# EAGLE design igvv (EAGLE 9.6.2)
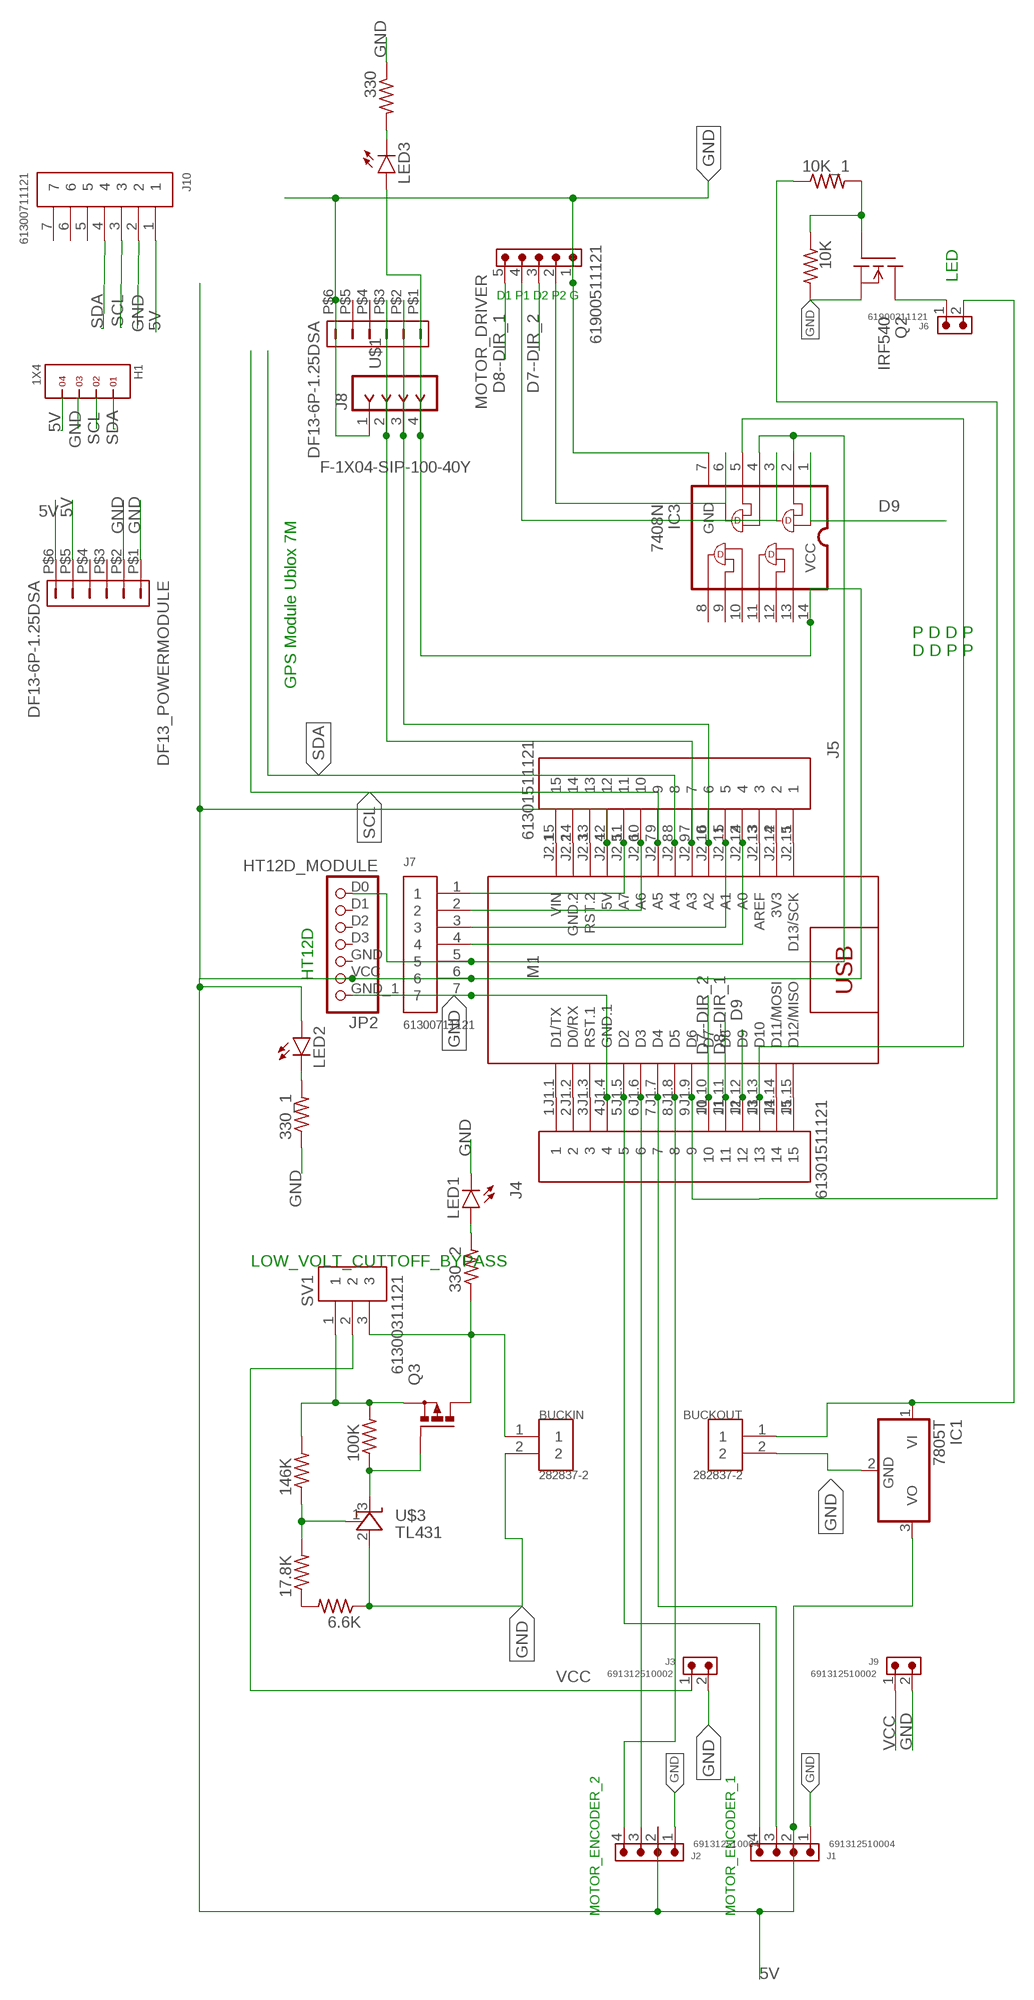
[diagram p0: schematic, sheet 1]

## Parts
6.6K  R-US_0207/10  [0207/10]
10K  R-US_0207/10  [0207/10]
10K_1  R-US_0207/10  [0207/10]
17.8K  R-US_0207/10  [0207/10]
100K  R-US_0207/10  [0207/10]
146K  R-US_0207/10  [0207/10]
330  R-US_0207/10  [0207/10]
330_1  R-US_0207/10  [0207/10]
330_2  R-US_0207/10  [0207/10]
BUCKIN  282837-2  [TE_282837-2]
BUCKOUT  282837-2  [TE_282837-2]
DF13_POWERMODULE  DF13-6P-1.25DSA  [DF13-6P-1.25DSA]
H1  1X4  [1X4]
IC1  7805T  [TO220H]
IC3  7408N  [DIL14]
J1  691312510004  691312510004  [691312510004]
J2  691312510004  691312510004  [691312510004]
J3  691312510002  691312510002  [691312510002]
J4  61301511121  [61301511121]
J5  61301511121  [61301511121]
J6  61900211121  61900211121  [61900211121]
J7  61300711121  [61300711121]
J8  F-1X04-SIP-100-40Y  [SIP-100-04-40Y]
J9  691312510002  691312510002  [691312510002]
J10  61300711121  [61300711121]
JP2  HT12D_MODULE  [HT12D_MODULE]
LED1  LED5MM  [LED5MM]
LED2  LED5MM  [LED5MM]
LED3  LED5MM  [LED5MM]
M1  ARDUINO-NANO-3.0ARDUINO-NANO-3.0  [ARDUINO-NANO-3.0]
MOTOR_DRIVER  61900511121  61900511121  [61900511121]
Q2  IRF540  [TO220]
Q3  PMOSFET_PTO220BV  [TO220BV]
SV1  61300311121  [61300311121]
U$1  DF13-6P-1.25DSA  [DF13-6P-1.25DSA]
U$3  TL431  [TO-92]

## Nets
5V: DF13_POWERMODULE.P$5 DF13_POWERMODULE.P$6 H1.4 IC1.3(VO) IC3.14(VCC) J1.2 J2.2 J5.12 J7.6 J8.4 J10.1 JP2.VCC LED2.A LED3.A M1.J2.4(5V) U$1.P$1
A2: J5.6 J8.3 M1.J2.10(A2) U$1.P$2
D4: J1.3 J4.7 M1.J1.7(D4)
D7--DIR_2: J4.10 M1.J1.10(D7) MOTOR_DRIVER.3
D8--DIR_1: J4.11 M1.J1.11(D8) MOTOR_DRIVER.5
D9: IC3.1 J4.12 M1.J1.12(D9)
GND: 6.6K.1 10K.2 330.1 330_1.1 BUCKIN.2 BUCKOUT.2 DF13_POWERMODULE.P$1 DF13_POWERMODULE.P$2 H1.3 IC1.2(GND) IC3.7(GND) J1.1 J2.1 J3.2 J4.4 J7.7 J8.1 J9.2 J10.2 JP2.GND_1 LED1.K(C) M1.J1.4(GND.1) MOTOR_DRIVER.1 Q2.3(S) U$1.P$6 U$3.2(A)
N$1: 6.6K.2 17.8K.1
N$2: 17.8K.2 146K.1 U$3.1(REF)
N$3: J1.4 J4.5 M1.J1.5(D2)
N$4: 100K.1 Q3.G U$3.3(C)
N$5: 330_2.1 BUCKIN.1 Q3.D SV1.3
N$6: 100K.2 146K.2 Q3.S SV1.1
N$7: BUCKOUT.1 IC1.1(VI) J6.2
N$8: J2.3 J4.6 M1.J1.6(D3)
N$9: J2.4 J4.8 M1.J1.8(D5)
N$10: 10K_1.1 J4.9 M1.J1.9(D6)
N$11: 330.2 LED3.K(C)
N$12: J5.4 J7.4 M1.J2.12(A0)
N$13: J5.5 J7.3 M1.J2.11(A1)
N$14: J5.10 J7.2 M1.J2.6(A6)
N$15: J5.11 J7.1 M1.J2.5(A7)
N$16: 330_2.2 LED1.A
N$17: 330_1.2 LED2.K(C)
N$21: J4.1 M1.J1.1(D1/TX)
N$22: J5.7 J8.2 M1.J2.9(A3) U$1.P$3
N$27: IC3.2 IC3.4 J7.5 JP2.D0
N$28: J4.2 M1.J1.2(D0/RX)
N$29: J4.3 M1.J1.3(RST.1)
N$31: J4.14 M1.J1.14(D11/MOSI)
N$32: J4.15 M1.J1.15(D12/MISO)
N$33: J5.1 M1.J2.15(D13/SCK)
N$34: J5.2 M1.J2.14(3V3)
N$35: J5.3 M1.J2.13(AREF)
N$36: J5.13 M1.J2.3(RST.2)
N$37: J5.14 M1.J2.2(GND.2)
N$38: J5.15 M1.J2.1(VIN)
N$39: 10K.1 10K_1.2 Q2.1(G)
N$40: J6.1 Q2.2(D)
N$42: IC3.5 J4.13 M1.J1.13(D10)
N$47: IC3.3 MOTOR_DRIVER.4
N$48: IC3.6 MOTOR_DRIVER.2
SCL: H1.2 J5.9 J10.3 M1.J2.7(A5)
SDA: H1.1 J5.8 J10.4 M1.J2.8(A4)
VCC: J3.1 J9.1 SV1.2
Unconnected: DF13_POWERMODULE.P$3 DF13_POWERMODULE.P$4 IC3.8 IC3.9 IC3.10 IC3.11 IC3.12 IC3.13 J10.5 J10.6 J10.7 JP2.D1 JP2.D2 JP2.D3 JP2.GND U$1.P$4 U$1.P$5

## Notes on the sheet
- LED
- D1 P1 D2 P2 G
- GPS Module Ublox 7M
- P D D P
  D D P P
- HT12D
- LOW_VOLT_CUTTOFF_BYPASS
- MOTOR_ENCODER_2 | MOTOR_ENCODER_1

## Library data of the parts
6.6K 10K 10K_1 17.8K 100K 146K 330 330_1 330_2 = rcl:R-US_: RESISTOR, American symbol; SPICEPREFIX: R
BUCKIN BUCKOUT = 282837-2:282837-2: TERM BLOCK 5.08MM 2POS SIDE ENTY Check availability <https://pricing.snapeda.com/parts/282837-2/TE%20Connectivity/view-part?ref=eda>; AVAILABILITY: In Stock; CHECK_PRICES: https://www.snapeda.com/parts/282837-2/TE+Connectivity+AMP+Connectors/view-part/?ref=eda; COMMENT: 282837-2; DESCRIPTION: Terminal Block Connector Wire Receptacle 2 5.08 mm 30-16 AWG Green 13.5 A 250 V | TE Connectivity 282837-2; MF: TE Connectivity; MP: 282837-2; PACKAGE: None; PRICE: None; PURCHASE-URL: https://www.snapeda.com/api/url_track_click_mouser/?unipart_id=2549980&manufacturer=TE Connectivity&part_name=282837-2&search_term=None; SNAPEDA_LINK: https://www.snapeda.com/parts/282837-2/TE+Connectivity+AMP+Connectors/view-part/?ref=snap
DF13_POWERMODULE U$1 = con-hirose-df13:DF13-6P-1.25: DF13-6P 1.25mm Pitch Miniature Crimping Connector.
H1 = headers(.1in):1X4
IC1 = igvc_custom:7805: Positive VOLTAGE REGULATOR Source: http://cache.national.com/ds/LM/LM78L05.pdf http://www.fairchildsemi.com/ds/LM/LM7805.pdf
IC3 = igvc_custom:7408: Quad 2-input AND gate
J1 J2 = Wurth_Connectors_WR-TBL Pluggable Connector:691312510004: WR-TBL Serie 312 - 5.08 mm Open Horizontal PCB Header KIND PROPERTIES Pitch 5.08 mm MATERIAL PROPERTIES Insulator Material PBT Insulator Flammability Rating UL94 V-0 Contact Material Brass Contact Plating Tin GENERAL INFORMATION Operating Temperature -40 up to +105 °C Compliance RoHS ELECTRICAL PROPERTIES IR cULus 20 A IR VDE 20 A Working Voltage [cULus] 300 V (AC) Working Voltage [VDE] 300 V (AC) Withstanding Voltage [cULus] 1600 V (AC) Withstanding Voltage [VDE] 2500 V (AC) Contact Resistance [cULus] 20 mΩ Contact Resistance [VDE] 20 mΩ CERTIFICATION cULus Approval E315414 VDE Approval 40023195 <https://www.we-online.com/catalog/media/o33262v209%20Family_WR-TBL_6913125100xx.jpg> Details see: https://www.we-online.com/catalog/en/TBL_5_08_312_OPEN_HORIZONTAL_PCB_HEADER_6913125100XX/ Updated by Ella Wu 2019-12-26 2019(C) Wurth Elektronik; DATASHEET-URL: https://www.we-online.com/catalog/datasheet/691312510004.pdf; IR-UL: 20A; IR-VDE: 20A; MOUNT: THT; PART-NUMBER: 691312510004; PINS: 4; PITCH: 5.08mm; TYPE: Horizontal; WORKING-VOLTAGE-UL: 300V (AC); WORKING-VOLTAGE-VDE: 300V (AC)
J3 J9 = Wurth_Connectors_WR-TBL Pluggable Connector:691312510002: WR-TBL Serie 312 - 5.08 mm Open Horizontal PCB Header KIND PROPERTIES Pitch 5.08 mm MATERIAL PROPERTIES Insulator Material PA66 Insulator Flammability Rating UL94 V-0 Contact Material Brass Contact Plating Tin GENERAL INFORMATION Operating Temperature -40 up to +105 °C Compliance RoHS ELECTRICAL PROPERTIES IR cULus 20 A IR VDE 20 A Working Voltage [cULus] 300 V (AC) Working Voltage [VDE] 300 V (AC) Withstanding Voltage [cULus] 1600 V (AC) Withstanding Voltage [VDE] 2500 V (AC) Contact Resistance [cULus] 20 mΩ Contact Resistance [VDE] 20 mΩ CERTIFICATION cULus Approval E315414 VDE Approval 40023195 <https://www.we-online.com/catalog/media/o33262v209%20Family_WR-TBL_6913125100xx.jpg> Details see: https://www.we-online.com/catalog/en/TBL_5_08_312_OPEN_HORIZONTAL_PCB_HEADER_6913125100XX/ Updated by Ella Wu 2019-12-26 2022(C) Wurth Elektronik; DATASHEET-URL: https://www.we-online.com/redexpert/spec/691312510002?ae; IR-UL: 20A; IR-VDE: 20A; MOUNT: THT; PART-NUMBER: 691312510002; PINS: 2; PITCH: 5.08mm; TYPE: Horizontal; WORKING-VOLTAGE-UL: 300V (AC); WORKING-VOLTAGE-VDE: 300V (AC)
J4 J5 = Headers:61301511121: CONN HEADER VERT 15POS 2.54MM Manufacturer's datasheet <https://katalog.we-online.de/em/datasheet/6130xx11121.pdf>; CREATED_BY: PCBLayout.com; DIGIKEY_PART_NUMBER: 732-5326-ND; MANUFACTURER: Wurth Electronics Inc.; MPN: 61301511121
J6 = Wurth_Connectors_WR-WTB:61900211121: WR-WTB 2.54 mm Male Locking Header KIND PROPERTIES: Pitch:2.54 mm Gender:Male MATERIAL PROPERTIES: Insulator Material :PA66 Insulator Flammability Rating:UL94 V-0 Insulator Color:Beige Contact Material:Copper Alloy Contact Plating:Tin Contact Type:Stamped GENERAL INFORMATION Operating Temperature:-40 up to +105 °C Compliance: RoHS Working Voltage:250 V (AC) Withstanding Voltage:1000 V (AC) Contact Resistance:20 mΩ RISO:1000 MΩ CERTIFICATION UL Approval:E323964 PACKAGING PROPERTIES Packaging:Bag <https://katalog.we-online.com/media/images/v2/o33345v209%20Family_WR-WTB_6190xx11121.jpg> Details see: https://katalog.we-online.com/en/em/WTB_2_54_MALE_LOCKING_HEADER_6190XX11121 Updated by Ella Wu 2020-07-08 2020 (C) Würth Elektronik; CONTACT-RESISTANCE: 20mOhm; DATASHEET-URL: https://www.we-online.com/catalog/datasheet/61900211121.pdf; GENDER: Male; L: 5.08mm; MOUNT: THT; PACKAGING: Bag; PART-NUMBER: 61900211121; PCB-CABLE-PANEL: PCB; PINS: 2; PITCH: 2.54mm; TOL-R: max.; TYPE: Vertical; USE-WITH: WR-WTB 2.54 mm Female Terminal Housing; WORKING-VOLTAGE: 250V(AC)
J7 J10 = Headers:61300711121: CONN HEADER VERT 7POS 2.54MM Manufacturer's datasheet <https://katalog.we-online.de/em/datasheet/6130xx11121.pdf>; CREATED_BY: PCBLayout.com; DIGI_KEY_PART_NUMBER: 732-5320-ND; MANUFACTURER: Wurth Electronics Inc.; MPN: 61300711121
J8 = con-headers-jp:F-1X04-: FEMALE HEADER
JP2 = igvc_custom:HT12D_MODULE
LED1-LED3 = led:LED: LED OSRAM: - CHIPLED LG R971, LG N971, LY N971, LG Q971, LY Q971, LO R971, LY R971 LH N974, LH R974 LS Q976, LO Q976, LY Q976 LO Q996 - Hyper CHIPLED LW Q18S LB Q993, LB Q99A, LB R99A - SideLED LS A670, LO A670, LY A670, LG A670, LP A670 LB A673, LV A673, LT A673, LW A673 LH A674 LY A675 LS A676, LA A676, LO A676, LY A676, LW A676 LS A679, LY A679, LG A679 - Hyper Micro SIDELED® LS Y876, LA Y876, LO Y876, LY Y876 LT Y87S - SmartLED LW L88C, LW L88S LB L89C, LB L89S, LG L890 LS L89K, LO L89K, LY L89K LS L896, LA L896, LO L896, LY L896 - TOPLED LS T670, LO T670, LY T670, LG T670, LP T670 LSG T670, LSP T670, LSY T670, LOP T670, LYG T670 LG T671, LOG T671, LSG T671 LB T673, LV T673, LT T673, LW T673 LH T674 LS T676, LA T676, LO T676, LY T676, LB T676, LH T676, LSB T676, LW T676 LB T67C, LV T67C, LT T67C, LS T67K, LO T67K, LY T67K, LW E67C LS E67B, LA E67B, LO E67B, LY E67B, LB E67C, LV E67C, LT E67C LW T67C LS T679, LY T679, LG T679 LS T770, LO T770, LY T770, LG T770, LP T770 LB T773, LV T773, LT T773, LW T773 LH T774 LS E675, LA E675, LY E675, LS T675 LS T776, LA T776, LO T776, LY T776, LB T776 LHGB T686 LT T68C, LB T68C - Hyper Mini TOPLED® LB M676 - Mini TOPLED Santana® LG M470 LS M47K, LO M47K, LY M47K Source: http://www.osram.convergy.de LUXEON: - LUMILED® LXK2-PW12-R00, LXK2-PW12-S00, LXK2-PW14-U00, LXK2-PW14-V00 LXK2-PM12-R00, LXK2-PM12-S00, LXK2-PM14-U00 LXK2-PE12-Q00, LXK2-PE12-R00, LXK2-PE12-S00, LXK2-PE14-T00, LXK2-PE14-U00 LXK2-PB12-K00, LXK2-PB12-L00, LXK2-PB12-M00, LXK2-PB14-N00, LXK2-PB14-P00, LXK2-PB14-Q00 LXK2-PR12-L00, LXK2-PR12-M00, LXK2-PR14-Q00, LXK2-PR14-R00 LXK2-PD12-Q00, LXK2-PD12-R00, LXK2-PD12-S00 LXK2-PH12-R00, LXK2-PH12-S00 LXK2-PL12-P00, LXK2-PL12-Q00, LXK2-PL12-R00 Source: www.luxeon.com KINGBRIGHT: KA-3528ASYC Source: www.kingbright.com
M1 = igvc_custom:ARDUINO-NANO-3.0: Arduino Nano 3.0 and compatible devices More details available here: https://www.arduino.cc/en/Main/ArduinoBoardNano Click here to find device on ebay.com <http://www.ebay.com/sch/arduino+nano>
MOTOR_DRIVER = Wurth_Connectors_WR-WTB:61900511121: WR-WTB 2.54 mm Male Locking Header KIND PROPERTIES: Pitch:2.54 mm Gender:Male MATERIAL PROPERTIES: Insulator Material :PA66 Insulator Flammability Rating:UL94 V-0 Insulator Color:Beige Contact Material:Copper Alloy Contact Plating:Tin Contact Type:Stamped GENERAL INFORMATION Operating Temperature:-40 up to +105 °C Compliance: RoHS Working Voltage:250 V (AC) Withstanding Voltage:1000 V (AC) Contact Resistance:20 mΩ RISO:1000 MΩ CERTIFICATION UL Approval:E323964 PACKAGING PROPERTIES Packaging:Bag <https://katalog.we-online.com/media/images/v2/o33345v209%20Family_WR-WTB_6190xx11121.jpg> Details see: https://katalog.we-online.com/en/em/WTB_2_54_MALE_LOCKING_HEADER_6190XX11121 Updated by Ella Wu 2020-07-08 2020 (C) Würth Elektronik; CONTACT-RESISTANCE: 20mOhm; DATASHEET-URL: https://www.we-online.com/catalog/datasheet/61900511121.pdf; GENDER: Male; L: 12.7mm; MOUNT: THT; PACKAGING: Bag; PART-NUMBER: 61900511121; PCB-CABLE-PANEL: PCB; PINS: 5; PITCH: 2.54mm; TOL-R: max.; TYPE: Vertical; USE-WITH: WR-WTB 2.54 mm Female Terminal Housing; WORKING-VOLTAGE: 250V(AC)
Q2 = igvc_custom:IRF540: N-Channel Enhancement MOSFET (HEXFET); 100V; 28A; 0,077Ohm
Q3 = transistor-power:PMOSFET_P: Power MOSFET P-Channel
SV1 = Headers:61300311121: CONN HEADER VERT 3POS 2.54MM Manufacturer's datasheet <https://katalog.we-online.de/em/datasheet/6130xx11121.pdf>; CREATED_BY: PCBLayout.com; DIGI_KEY_PART_NUMBER: 732-5316-ND; MANUFACTURER: Wurth Electronics Inc.; MPN: 61300311121
U$3 = GuShH:TL431

## Board
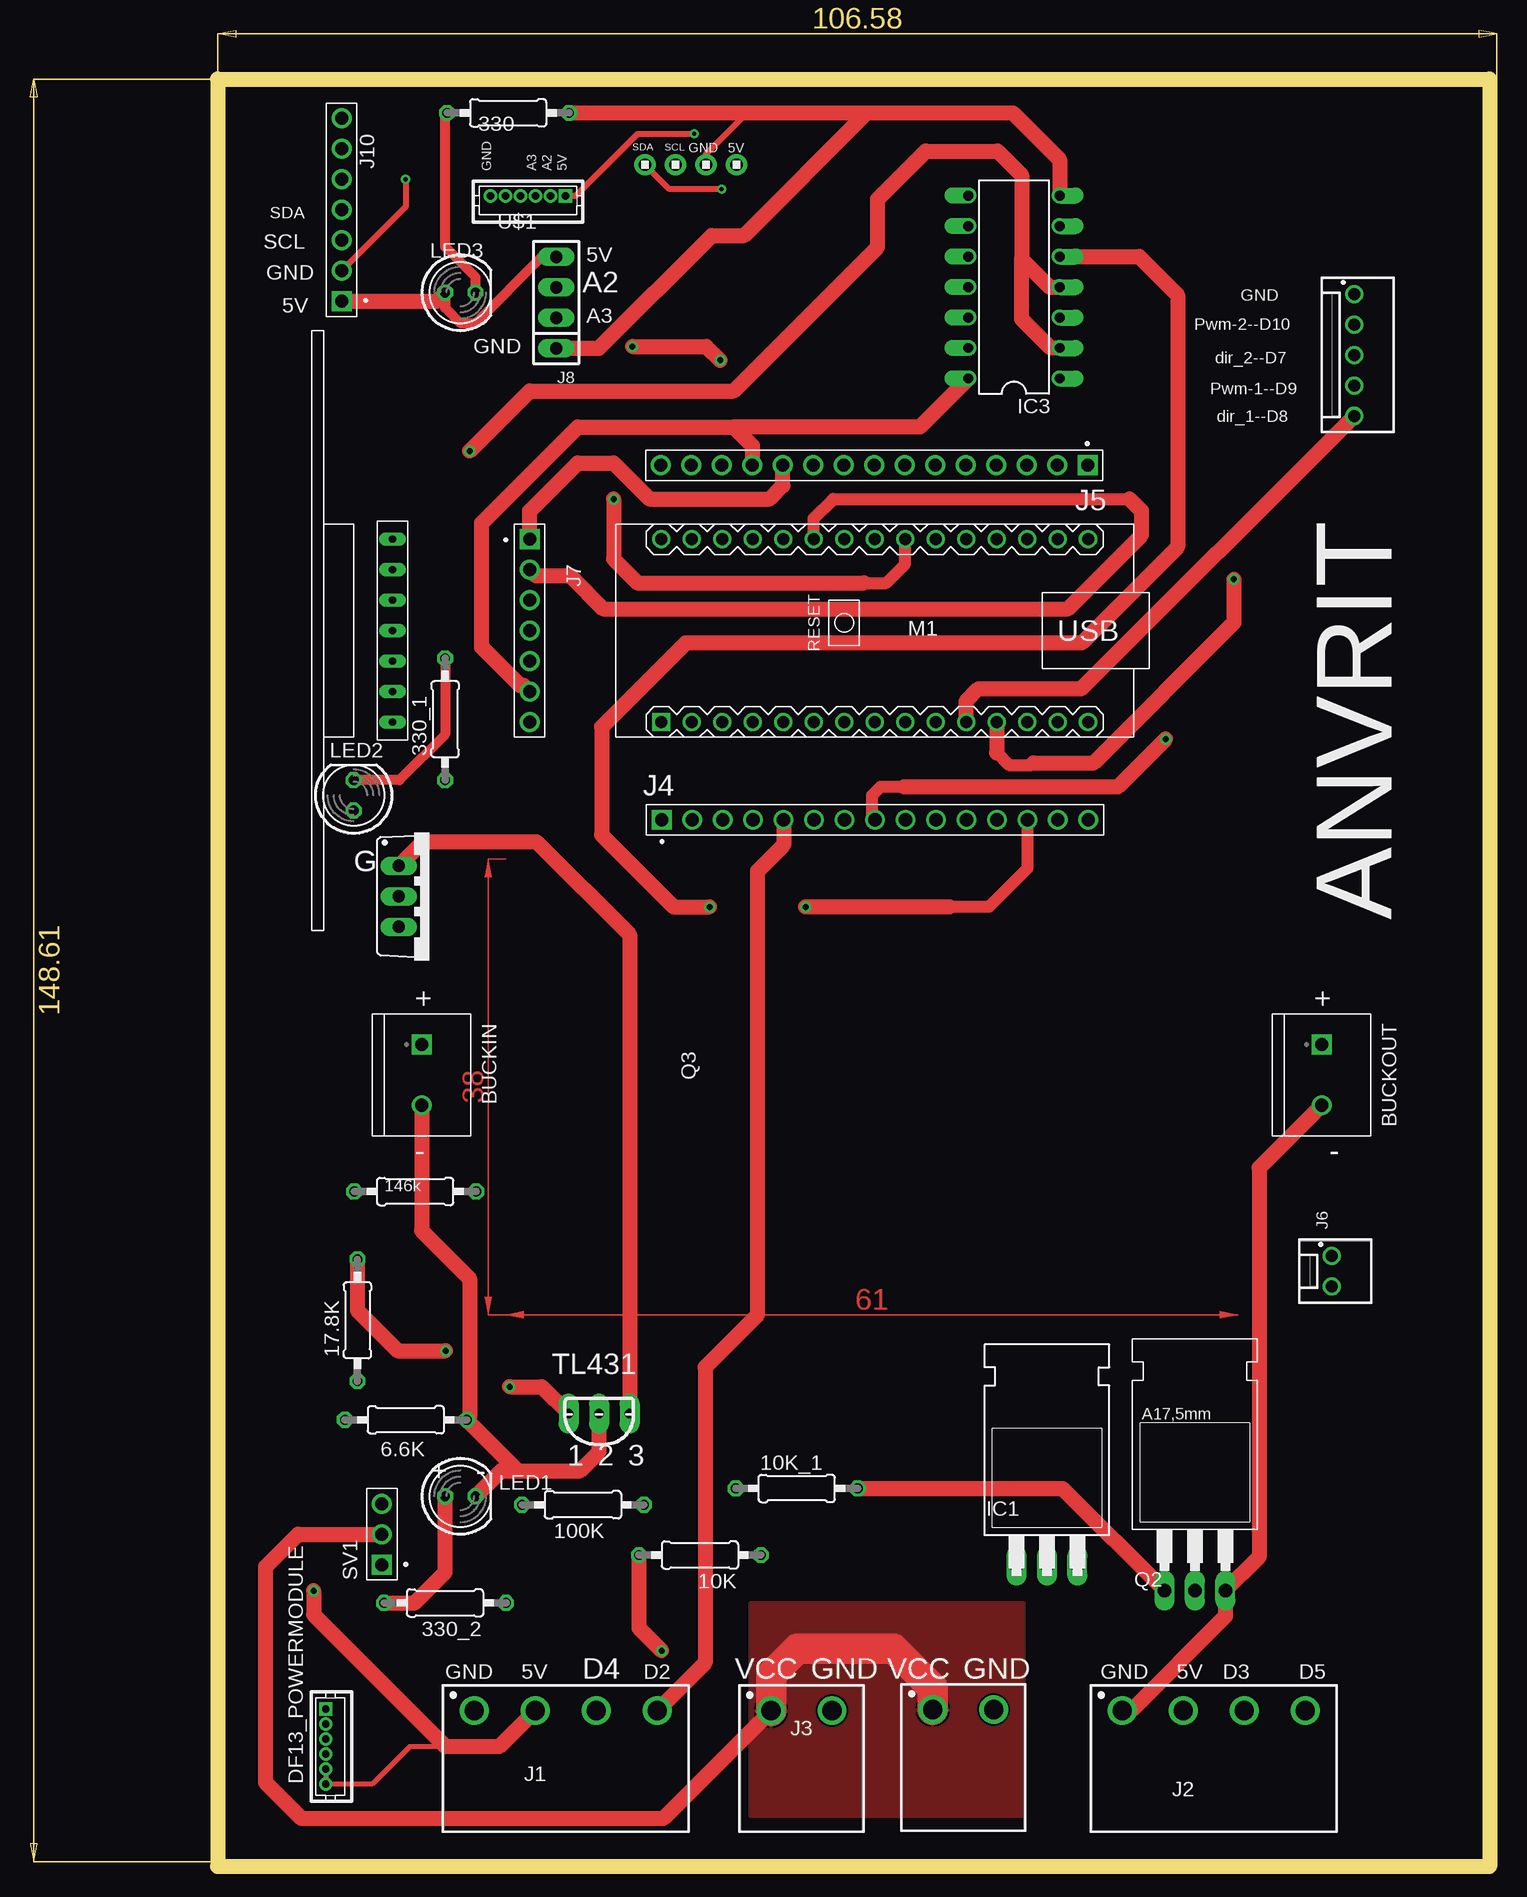
[diagram p1: board, top side]
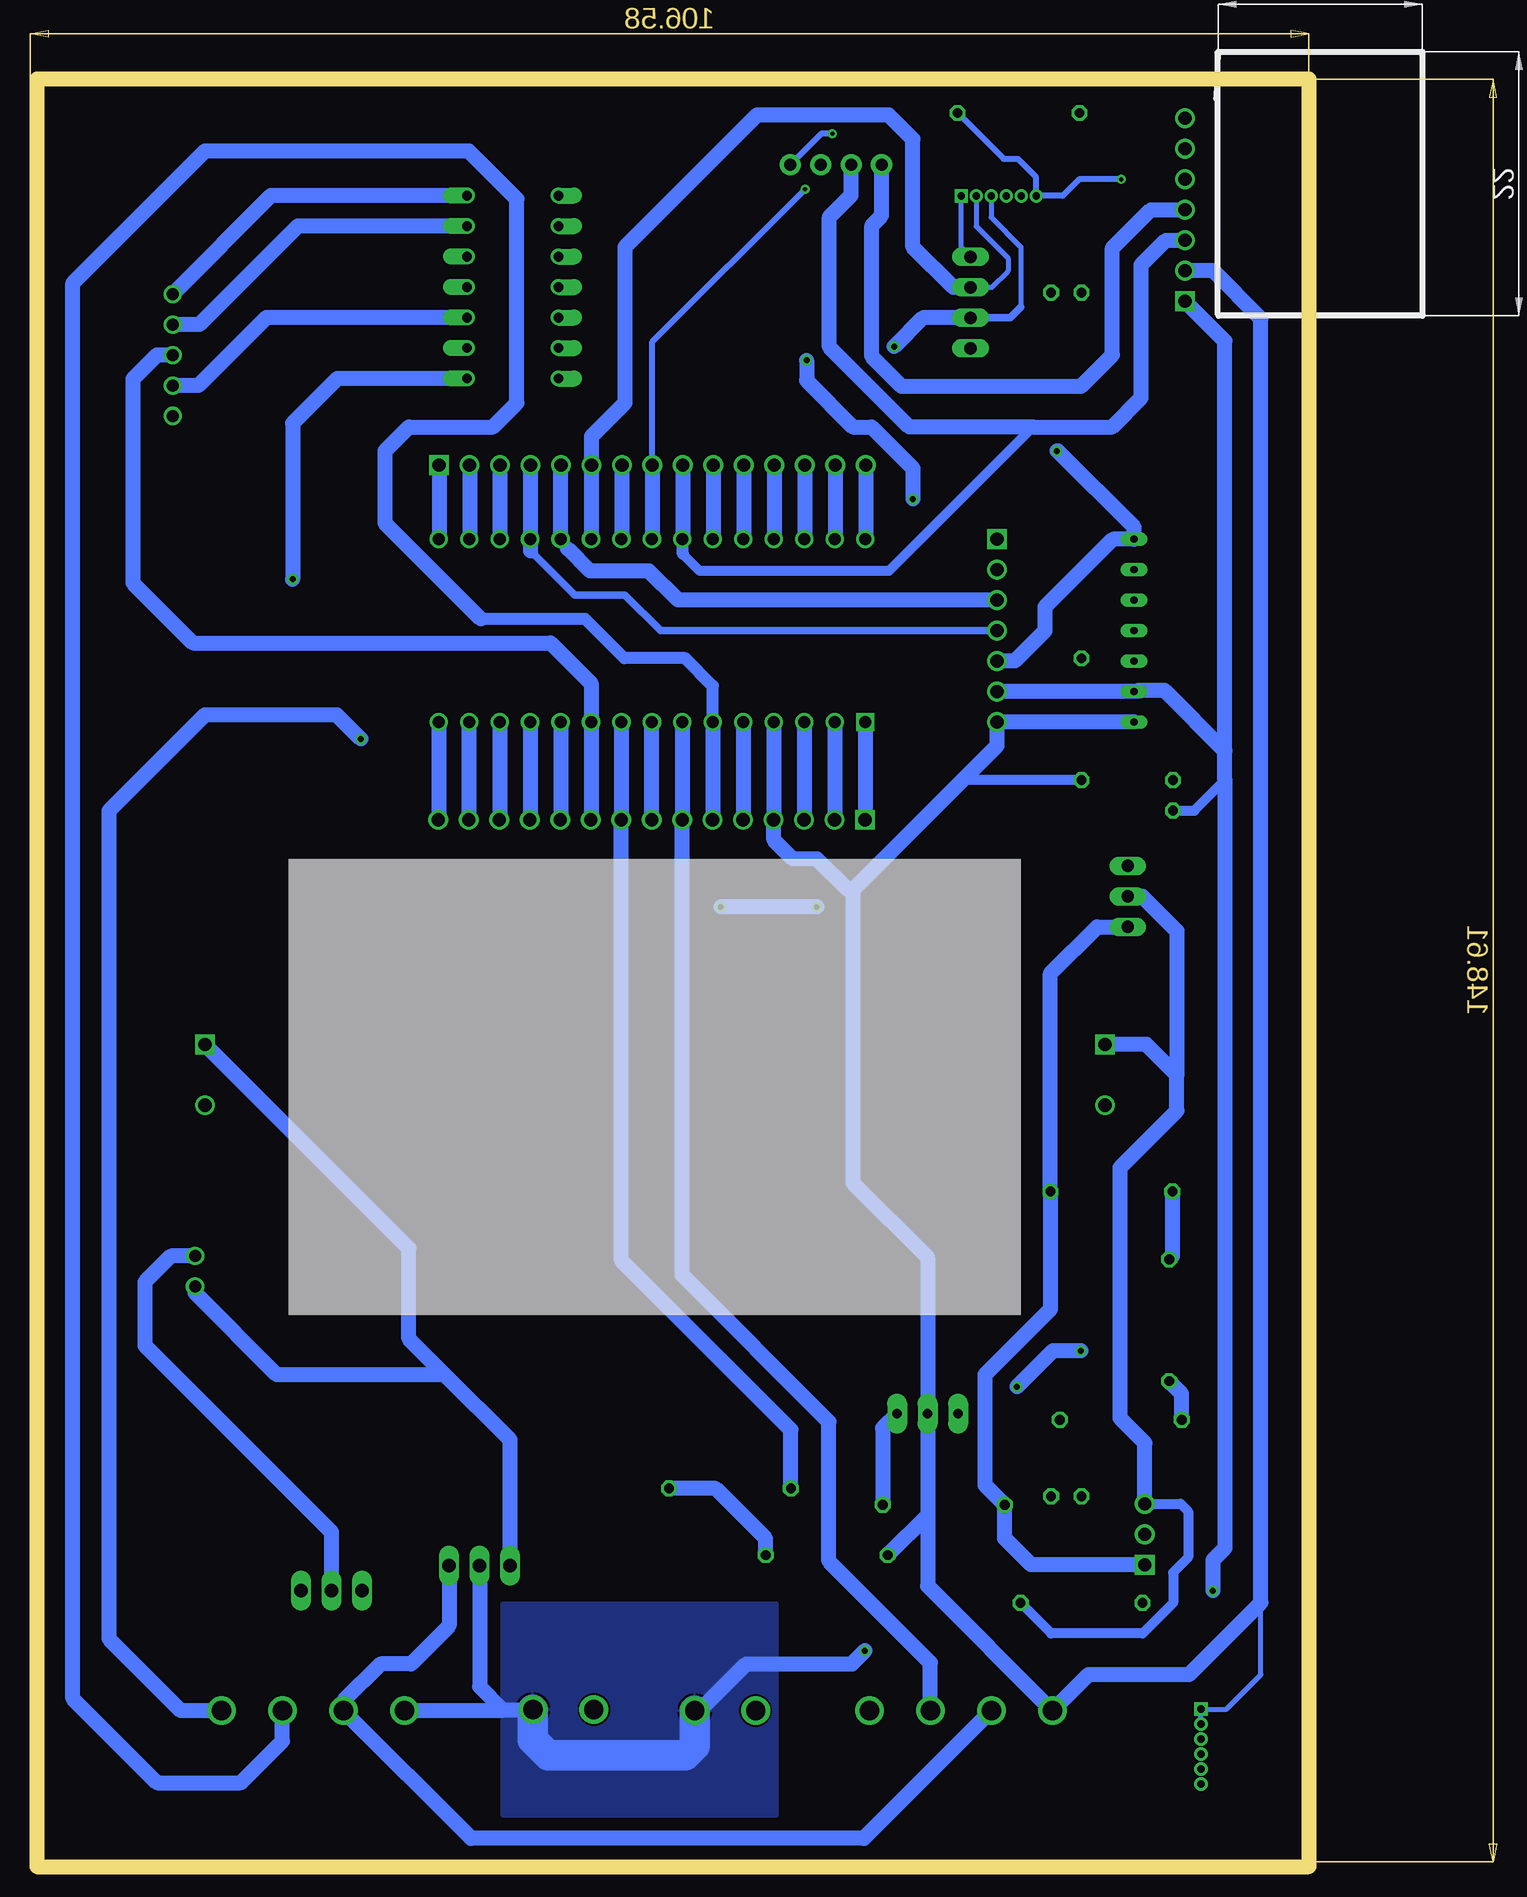
[diagram p2: board, bottom side, seen from below]

Size 106 x 149 mm. Coordinates in mm from the lower left corner, seen from the top.
Outline: 106,149 106,0 0,0 0,149 106,149
Copper layers (1*16): Top 0.035mm / dielectric 1.5mm / Bottom 0.035mm
Design rules "default": minimum track width 6mil, minimum drill 0.35mm, track to track 6mil, track to pad 6mil, pad to pad 6mil, via to via 6mil, smd to smd 6mil, copper to edge 40mil, drill to drill 6mil, minimum pad ring 10mil, minimum via ring 8mil, stop-mask expansion 4mil, vias tented up to drill 0mil, thermal gap 10mil

### Footprints (pad centres in the part's own frame; a part is rotated, then mirrored left to right if it is on the bottom)
0207/10 = drill 0.813 octagon: 1 -5.08,0; 2 5.08,0
TE_282837-2 = drill 1.1 square: 1 -2.54,0 | drill 1.1: 2 2.54,0
DF13-6P-1.25DSA = drill 0.6 pad 1.016 square: P$1 3.125,0 | drill 0.6 pad 1.016: P$2 1.875,0; P$3 0.625,0; P$4 -0.625,0; P$5 -1.875,0; P$6 -3.125,0
1X4 = drill 1.016 pad 1.778: 1 0,0; 2 2.54,0; 3 5.08,0; 4 7.62,0
TO220H = drill 1.118 long: 1 -2.54,-10.16; 2 0,-10.16; 3 2.54,-10.16
DIL14 = drill 0.813 offset: 1 -7.62,-3.81; 2 -5.08,-3.81; 3 -2.54,-3.81; 4 0,-3.81; 5 2.54,-3.81; 6 5.08,-3.81; 7 7.62,-3.81; 8 7.62,3.81; 9 5.08,3.81; 10 2.54,3.81; 11 0,3.81; 12 -2.54,3.81; 13 -5.08,3.81; 14 -7.62,3.81
691312510004 = drill 1.6: 1 -7.62,0; 2 -2.54,0; 3 2.54,0; 4 7.62,0
691312510002 = drill 1.6: 1 -2.54,0; 2 2.54,0
61301511121 = drill 1.1 square: 1 -17.78,0 | drill 1.1: 2 -15.24,0; 3 -12.7,0; 4 -10.16,0; 5 -7.62,0; 6 -5.08,0; 7 -2.54,0; 8 0,0; 9 2.54,0; 10 5.08,0; 11 7.62,0; 12 10.16,0; 13 12.7,0; 14 15.24,0; 15 17.78,0
61900211121 = drill 1: 1 1.27,0.3; 2 -1.27,0.3
61300711121 = drill 1.1 square: 1 -7.62,0 | drill 1.1: 2 -5.08,0; 3 -2.54,0; 4 0,0; 5 2.54,0; 6 5.08,0; 7 7.62,0
SIP-100-04-40Y = drill 1.016 long: 1 -3.81,0; 2 -1.27,0; 3 1.27,0; 4 3.81,0
HT12D_MODULE = drill 0.6 long: D0 -7.62,-1.27; D1 -5.08,-1.27; D2 -2.54,-1.27; D3 0,-1.27; GND 2.54,-1.27; GND_1 7.62,-1.27; VCC 5.08,-1.27
LED5MM = drill 0.813 octagon: A -1.27,0; K 1.27,0
ARDUINO-NANO-3.0 = drill 1 square: J1.1 17.78,7.62 | drill 1: J1.2 15.24,7.62; J1.3 12.7,7.62; J1.4 10.16,7.62; J1.5 7.62,7.62; J1.6 5.08,7.62; J1.7 2.54,7.62; J1.8 0,7.62; J1.9 -2.54,7.62; J1.10 -5.08,7.62; J1.11 -7.62,7.62; J1.12 -10.16,7.62; J1.13 -12.7,7.62; J1.14 -15.24,7.62; J1.15 -17.78,7.62; J2.1 17.78,-7.62; J2.2 15.24,-7.62; J2.3 12.7,-7.62; J2.4 10.16,-7.62; J2.5 7.62,-7.62; J2.6 5.08,-7.62; J2.7 2.54,-7.62; J2.8 0,-7.62; J2.9 -2.54,-7.62; J2.10 -5.08,-7.62; J2.11 -7.62,-7.62; J2.12 -10.16,-7.62; J2.13 -12.7,-7.62; J2.14 -15.24,-7.62; J2.15 -17.78,-7.62
61900511121 = drill 1: 1 5.08,0.3; 2 2.54,0.3; 3 0,0.3; 4 -2.54,0.3; 5 -5.08,0.3
TO220 = drill 1.118 long: 1 -2.54,-6.35; 2 0,-6.35; 3 2.54,-6.35
TO220BV = drill 1.016 long: D 0,-2.54; G -2.54,-2.54; S 2.54,-2.54
61300311121 = drill 1.1 square: 1 -2.54,0 | drill 1.1: 2 0,0; 3 2.54,0
TO-92 = drill 0.813 pad 1.676 long: 1 2.54,0.318; 2 0,0.318; 3 -2.54,0.318

### Placement (x,y rotation side)
6.6K  15.68,37.24 180 top
10K  40.19,25.97 180 top
10K_1  48.25,31.52 0 top
17.8K  11.65,45.54 90 top
100K  30.44,30.16 180 top
146K  16.46,56.27 0 top
330  24.2,146.18 180 top
330_1  18.95,95.64 90 top
330_2  18.95,21.98 180 top
BUCKIN  17,66 270 top
BUCKOUT  92,66 270 top
DF13_POWERMODULE  9,10 90 top
H1  35.61,141.86 0 top
IC1  69.11,35.26 0 top
IC3  66.36,131.66 90 top
J1  29,13 0 top
J2  83,13 0 top
J3  48.65,13 0 top
J4  54.78,87.25 0 top
J5  54.71,116.81 180 top
J6  93.13,49.62 90 top
J7  26,103.03 270 top
J8  28.21,130.37 90 top
J9  62.13,13.09 0 top
J10  10.33,138.1 90 top
JP2  15.84,103.03 270 top
LED1  20.22,30.87 0 top
LED2  11.33,89.29 90 top
LED3  20.22,131.2 0 top
M1  54.75,103.03 180 top
MOTOR_DRIVER  95,126 90 top
Q2  81.44,29.36 0 top
Q3  17.64,80.88 270 top
SV1  13.68,27.7 90 top
U$1  25.86,139.26 0 top
U$3  31.78,38.07 180 top

### Tracks (layer width: path | path; a pad name or v marks a point on that pad's centre or on a via)
5V  (via drill 0.35, 0.5)
  Top 0.406: 19,10 16,10 12.88,6.88 DF13_POWERMODULE.P$6 DF13_POWERMODULE.P$5
  Top 0.508: U$1.P$1 29.82,139.26 34.97,144.42 39.68,144.42 v39.71,144.45
  Top 0.813: LED3.A 18.95,129.93 20.22,128.66 21.49,128.66 27,134.18 J8.4
  Top 1.27: J7.6 25.48,98.47 25.16,98.47 22,101.64 22,112 30,120 43,120 | IC3.14 58.51,120 43,120 | 43,120 44.55,118.45 J5.12 | v8,23 8,21 19,10 23.46,10 J1.2 | J10.1 18.23,130.48 LED3.A
  Bottom 0.406: U$1.P$1 29,139.25 29,134.97 J8.4
  Bottom 0.508: v39.71,144.45 40.64,144.45 H1.4
  Bottom 0.813: LED2.A 9.54,88.02 7,90.56
  Bottom 1.27: J7.6 JP2.VCC 14.29,97.95 14.21,98.03 12.03,98.03 7,93 | J5.12 44.55,110.69 M1.J2.4 | v8,23 8,25.54 7,26.54 7,90.56 7,93 | J1.2 37.1,2.36 69.82,2.36 J2.2 80.46,13.81 77.37,16.9 74.83,16.9 71.65,20.08 IC1.3 | 7,93 7,127.15 J10.1
A2
  Bottom 0.406: U$1.P$2 27.73,136.73 25.07,134.07 25.07,133 26.43,131.63 J8.3
  Bottom 1.27: M1.J2.10 59.79,110.69 J5.6 59.79,119.21 57,122 57,135 46,146 35,146 33,144 33,135 29.63,131.63 J8.3
D4
  Bottom 1.27: M1.J1.7 52.21,87.28 J4.7 52.24,49.32 40,37.08 40,25.46 31.54,17 J1.3
D7--DIR_2
  Bottom 1.27: MOTOR_DRIVER.3 96,126 98,124 98,107 93,102 63.2,102 59.83,98.63 M1.J1.10 59.83,87.28 J4.10
D8--DIR_1
  Top 1.27: M1.J1.11 62.37,97.15 63.4,98.18 71.96,98.18 MOTOR_DRIVER.5
  Bottom 1.27: J4.11 62.37,87.28 M1.J1.11
D9  (via drill 0.5)
  Top 1.016: 64.91,92.86 65.94,91.83 67.83,91.83 68,92
  Top 1.27: v84.69,107.31 84.69,103.69 73,92 68,92 | M1.J1.12 64.91,92.86
  Bottom 1.27: IC3.1 80.96,124.04 84.69,120.31 v84.69,107.31 | M1.J1.12 64.91,87.28 J4.12
GND  (via drill 0.35, 0.5)
  Top 0.508: v15.65,140.64 15.65,138.35 J10.2 | H1.3 40.69,142.75 44.12,146.18 44.39,146.18
  Top 1.27: IC3.7 70.17,142.28 66.27,146.18 54.11,146.18 | 25,33 6.6K.1 21,37.48 21,49 17,53 BUCKIN.2 | U$3.2 31.78,34.58 30.2,33 25,33 | 10K.2 35.11,19.89 v37,18 | BUCKOUT.2 86.78,58.24 86.78,25.81 Q2.3 83.98,20.86 76.12,13 J2.1 | LED1.K 23.62,33 25,33 | 330.1 44.39,146.18 54.11,146.18 | 54.11,146.18 43.88,135.95 41.17,135.95 31.77,126.56 J8.1
  Bottom 0.406: DF13_POWERMODULE.P$2 DF13_POWERMODULE.P$1 6.87,13.12 4,16 4,22
  Bottom 0.508: 330.1 25.45,142.35 24.27,142.35 22.73,140.81 U$1.P$6 20.53,139.26 19.16,140.64 v15.65,140.64
  Bottom 0.813: 330_1.1 28.85,90.56 28.98,90.43
  Bottom 1.27: JP2.GND_1 J7.7 26,93.41 28.98,90.43 38,81.41 | M1.J1.4 44.59,87.28 | 44.59,87.28 J4.4 | IC3.7 86.5,139.28 MOTOR_DRIVER.1 | 38,81.41 38,57 31.78,50.78 U$3.2 31.78,29.3 | 31.78,29.3 31.78,23.4 J1.1 18.38,16 10,16 4,22 4,129.04 7.98,133.02 J10.2 | 31.78,29.3 10K.2 | 38,81.41 38.41,81.41 41,84 43,84 44.59,85.59 44.59,87.28 | v37,18 38.1,16.9 46.89,16.9 50.79,13 J3.2 | IC1.2 69.11,14.99 67.21,13.09 | 67.21,13.09 J9.2 | 67.21,13.09 67.3,13 J2.1
  Bottom 2.54: J3.2 51.19,10.06 51.97,9.28 63.4,9.28 64.67,10.55 J9.2
  pour Bottom: 44.35,21.98 44.35,4.2 67.21,4.2 67.21,21.98
N$1
  Bottom 1.27: 6.6K.2 10.6,39.41 17.8K.1
N$2  (via drill 0.5)
  Top 1.27: 17.8K.2 11.65,46.35 15,43 v19,43 | v24.33,40 27,40 U$3.1
  Bottom 1.27: 146K.1 11.38,50.89 17.8K.2 | v19,43 21.33,43 v24.33,40
N$3
  Top 1.27: J4.5 47.16,85.16 45,83 45,46 40.62,41.62 40.62,17 J1.4
  Bottom 1.27: M1.J1.5 47.13,87.28 J4.5
N$4
  Top 1.27: Q3.G 17.1,85.42 26.58,85.42 34.32,77.68 U$3.3
  Bottom 1.27: U$3.3 35.52,36.55 100K.1
N$5
  Bottom 0.813: SV1.3 10.7,30.24 10.06,29.6 10.06,25.79 11.33,24.52 11.33,21.98 13.87,19.44 21.49,19.44 330_2.1
  Bottom 1.27: SV1.3 13.68,35.32 15.73,37.37 15.73,58.27 11,63 11,66 | Q3.D 13.88,80.88 11,78 11,66 | BUCKIN.1 13.54,68.54 11,66
N$6
  Bottom 1.27: SV1.1 23.16,25.16 25.36,27.36 100K.2 27,31.8 27,41 21.54,46.46 146K.2 21.54,74.46 17.66,78.34 Q3.S
N$7
  Bottom 1.27: IC1.1 66.57,35.57 72,41 | 72,41 86,41 92.83,47.83 J6.2 | 72,41 75,44 75,51.54 BUCKOUT.1
N$8
  Bottom 1.016: M1.J1.6 49.67,98.42 51.97,100.72 57.05,100.72 60.33,104 69,104
  Bottom 1.27: M1.J1.6 49.67,87.28 J4.6 | 69,104 77,112 77,118 75,120 68,120 66,122 66,139 70,143 92,143 103,132 103,14 96,7 89,7 85.54,10.46 J2.3
N$9  (via drill 0.5)
  Top 1.016: 57.21,90 55.22,90 54.51,89.29 54.51,87.52 J4.8
  Top 1.27: v79,94 75,90 57.21,90
  Bottom 1.27: J2.4 94,13 100,19 100,88 92,96 81,96 v79,94 | J4.8 54.78,95.38 M1.J1.8
N$10
  Bottom 1.27: M1.J1.9 57.29,87.28 | 57.29,87.28 J4.9 | 10K_1.1 43.17,36.41 57.29,50.53 57.29,87.28
N$11
  Top 0.813: LED3.K 21.49,132.47 18.95,135.01 18.95,146 330.2
N$12
  Bottom 0.61: J7.4 54.03,103.03 57,106 61.19,106 64.87,109.69
  Bottom 1.27: J5.4 64.87,110.69 | 64.87,110.69 64.87,109.69 | 64.87,110.69 M1.J2.12
N$13
  Bottom 1.016: 62.33,110.69 M1.J2.11 62.37,110.44 61.78,109.84
  Bottom 1.27: 62.33,110.69 J5.5 | J7.3 52.57,105.57 55,108 59.93,108 61.78,109.84
N$14
  Top 1.016: M1.J2.6 49.67,112.39 51.28,114 76,114
  Top 1.27: J7.2 26.52,107.59 29.39,107.59 32.15,104.83 70.83,104.83 77,111 77,113 76,114
  Bottom 1.27: J5.10 49.63,110.69 M1.J2.6
N$15
  Top 1.27: J7.1 26,113 30,117 33,117 36,114 46,114 47.09,115.09 J5.11
  Bottom 1.27: J5.11 47.09,110.69 M1.J2.5
N$16
  Top 1.27: 330_2.2 16.41,21.98 18.95,24.52 LED1.A
N$17
  Top 0.813: 330_1.2 18.95,94.37 15.14,90.56 LED2.K
N$21
  Bottom 1.27: M1.J1.1 36.97,87.28 J4.1
N$22  (via drill 0.5)
  Top 1.016: 53.85,107 55.71,107 57.29,108.58 M1.J2.9
  Top 1.27: v34.57,126.7 40.73,126.7 v41.87,125.57 | v33,114 33,109 35,107 53.85,107
  Bottom 0.406: U$1.P$3 26.48,137.48 24,135 24,130
  Bottom 0.61: J8.2 24.9,129.09 24,130
  Bottom 1.27: J5.7 57.25,110.69 M1.J2.9 | J8.2 32.18,129.09 v34.57,126.7 | v41.87,125.57 41.87,123.87 38,120 36.44,120 33,116.56 v33,114
N$27  (via drill 0.5)
  Top 1.27: v21,118 26,123 43,123 55,135 55,139 59,143 65,143 67,141 67,134 | 67,134 69.34,131.66 IC3.4 | IC3.2 69.42,126.58 67,129 67,134
  Bottom 1.27: J7.5 24.51,100.49 22,103 22,105 16.35,110.65 JP2.D0 14.57,111.65 20.92,118 v21,118
N$28
  Bottom 1.27: M1.J1.2 39.51,87.28 J4.2
N$29
  Bottom 1.27: M1.J1.3 42.05,87.28 J4.3
N$31
  Bottom 1.27: M1.J1.14 70,87.27 J4.14
N$32
  Bottom 1.27: M1.J1.15 72.53,87.28 J4.15
N$33
  Bottom 1.27: J5.1 72.49,110.69 M1.J2.15
N$34
  Bottom 1.27: J5.2 69.95,110.69 M1.J2.14
N$35
  Bottom 1.27: J5.3 67.41,110.69 M1.J2.13
N$36
  Bottom 1.27: J5.13 42.01,110.69 M1.J2.3
N$37
  Bottom 1.27: J5.14 39.47,110.69 M1.J2.2
N$38
  Bottom 1.27: J5.15 36.93,110.69 M1.J2.1
N$39
  Top 1.27: 10K_1.2 70.39,31.52 Q2.1
  Bottom 1.27: 10K.1 45.27,27.34 49.45,31.52 10K_1.2
N$40
  Bottom 1.27: Q2.2 81.44,27.87 97,43.43 97,48.72 94.83,50.89 J6.1
N$42  (via drill 0.5)
  Top 1.016: J4.13 67.48,83.21 64.27,80 61,80
  Top 1.27: IC3.5 76.8,134.2 80,131 80,110 72,102 39,102 32,95 32,86 38,80 v41,80 | 61,80 v49,80
  Bottom 1.27: M1.J1.13 67.45,87.28 J4.13 | v41,80 v49,80
N$47
  Bottom 1.27: IC3.3 86.88,129.12 92.54,123.46 MOTOR_DRIVER.4
N$48
  Bottom 1.27: IC3.6 84.26,136.74 92.46,128.54 MOTOR_DRIVER.2
SCL
  Bottom 0.813: 52.17,109.42 50.76,108 35,108 23,120
  Bottom 1.016: 52.17,109.42 52.17,110.69
  Bottom 1.27: J5.9 52.17,110.69 M1.J2.7 | J10.3 11.93,135.56 13.98,133.51 13.98,122.43 16.41,120 23,120 33.3,120 39.97,126.67 39.97,137.49 38.15,139.31 H1.2
SDA  (via drill 0.35)
  Top 0.508: v41.99,139.82 37.65,139.82 H1.1
  Bottom 0.508: J5.8 54.71,127.09 v41.99,139.82
  Bottom 1.27: J5.8 54.71,110.69 M1.J2.8 | J10.4 13.18,138.1 16.38,134.91 16.38,126.01 18.98,123.4 33.96,123.4 36.43,125.87 36.43,136.79 35.61,137.62 H1.1
VCC
  Top 1.27: J3.1 37.11,4 7,4 4,7 4,25 6.7,27.7 SV1.2
  Top 2.54: J3.1 46.11,16 48.28,18.17 56.33,18.17 59.59,14.91 J9.1
  pour Top: 44.35,21.98 44.35,5.47 44.35,4.2 67.21,4.2 67.21,21.98
(copper drawn outside any net)
  shapes: Top area x2

### Text on the board
tNames: GND | 5V | SDA | SCL | GND | A3 | A2 | 5V | SDA | SCL | 5V | GND | 5V | A2 | A3 | GND | Pwm-2--D10 | GND | dir_2--D7 | Pwm-1--D9 | dir_1--D8 | G | ANVRIT | + | + | - | 146k | TL431 | 1 | 2 | 3 | GND | 5V | D4 | D2 | VCC | GND | VCC | GND | GND | 5V | D3 | D5
_tsilk: - | + | -